# EAGLE design BlackIceMx (EAGLE 7.7.0)
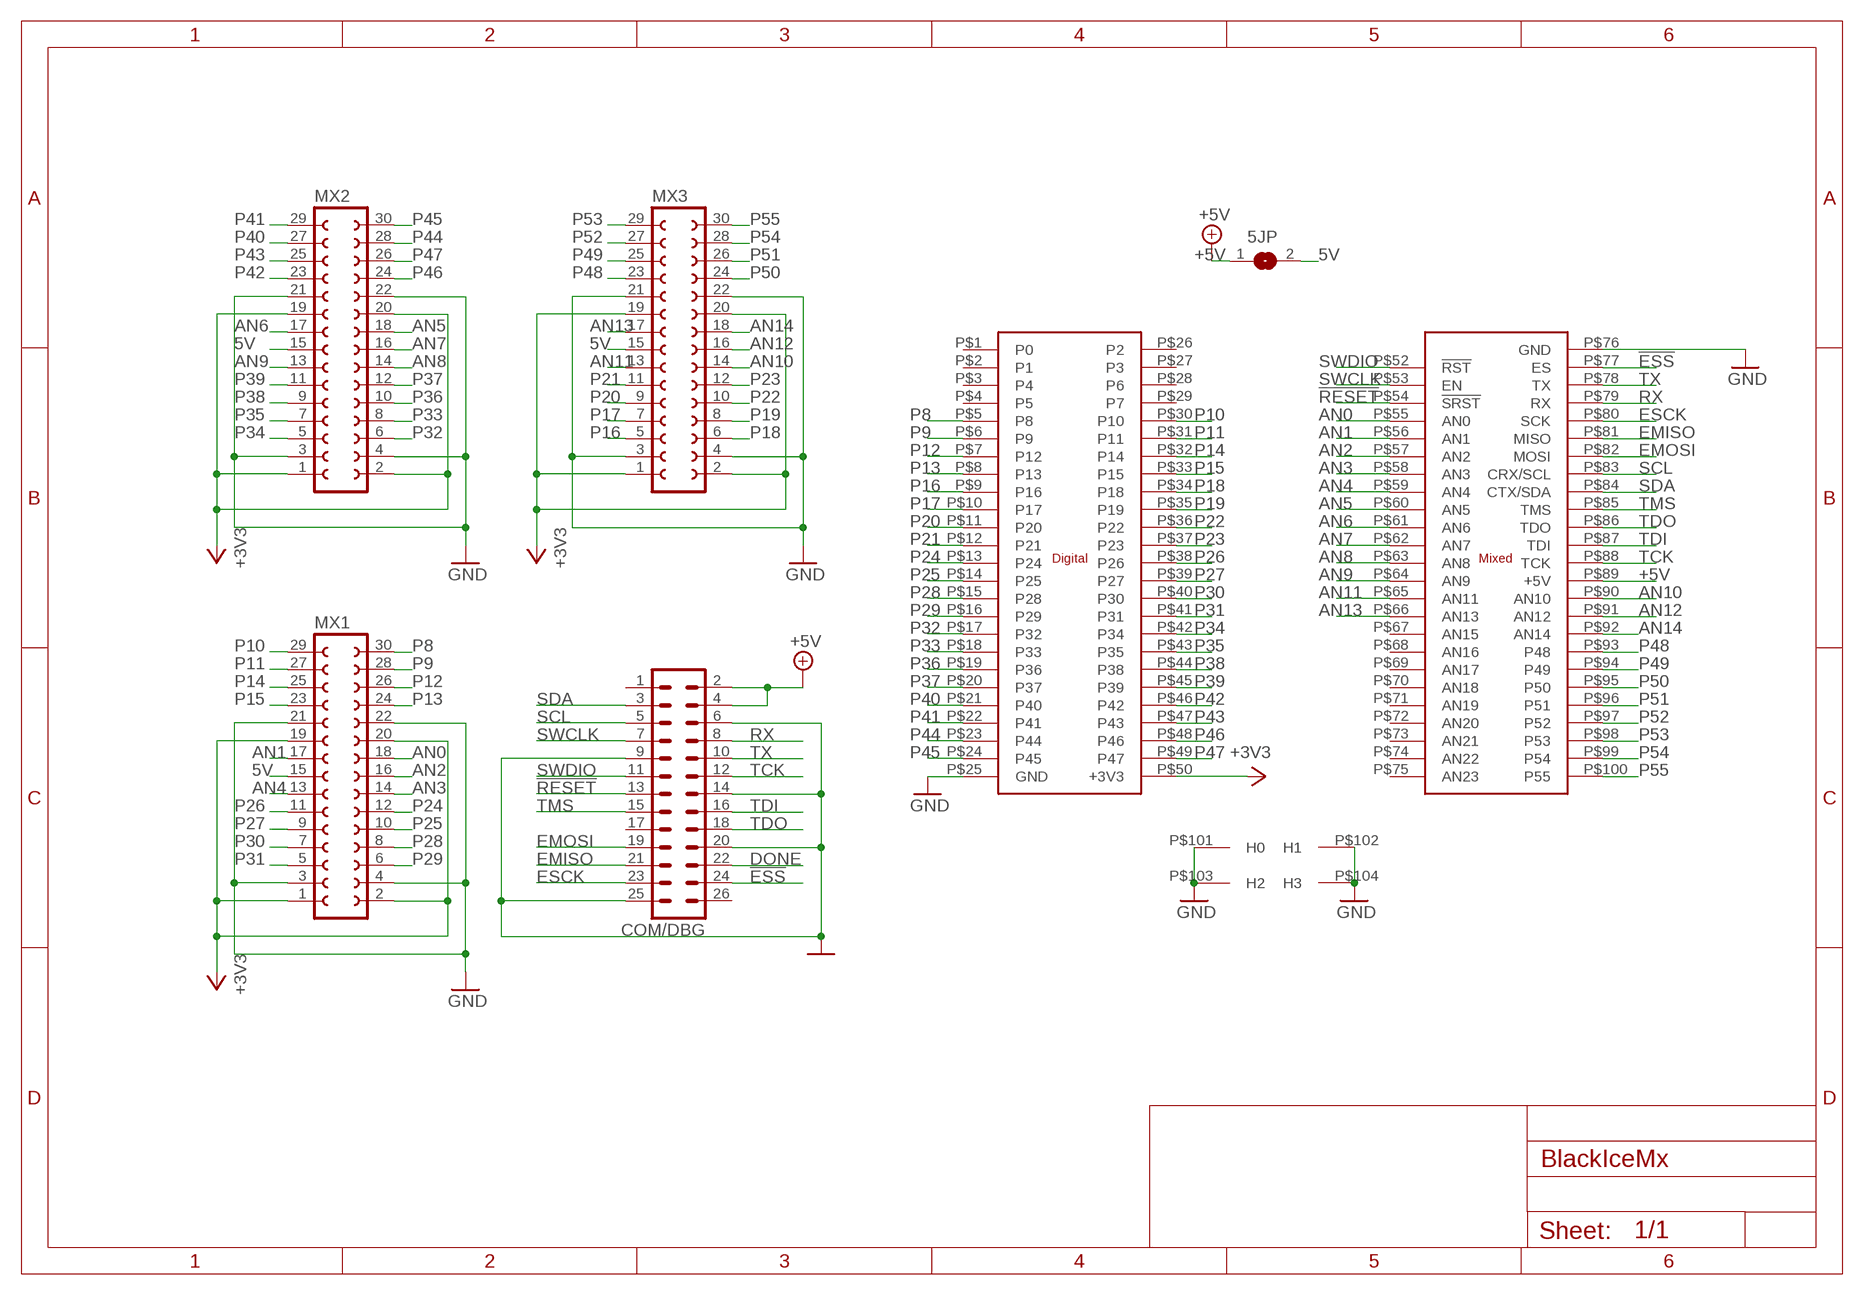
[diagram p0: schematic, sheet 1]

## Parts
5JP  SJ  [SJ]
COM/DBG  MA13-2  [MA13-2]
MX1  FE15-2  [FE15-2]
MX2  FE15-2  [FE15-2]
MX3  FE15-2  [FE15-2]
U$1  BE-CARRIERSMD  [BE-CARRIER-SMD]

## Nets
5V: 5JP.2 MX1.15 MX2.15 MX3.15
!ESS: COM/DBG.24 U$1.P$77(ES)
!RESET: COM/DBG.13 U$1.P$54(!SRST)
+3V3: MX1.1 MX1.2 MX1.19 MX1.20 MX2.1 MX2.2 MX2.19 MX2.20 MX3.1 MX3.2 MX3.19 MX3.20 U$1.P$50(+3V3)
+5V: 5JP.1 COM/DBG.2 COM/DBG.4 U$1.P$89(+5V)
AN0: MX1.18 U$1.P$55(AN0)
AN1: MX1.17 U$1.P$56(AN1)
AN2: MX1.16 U$1.P$57(AN2)
AN3: MX1.14 U$1.P$58(AN3)
AN4: MX1.13 U$1.P$59(AN4)
AN5: MX2.18 U$1.P$60(AN5)
AN6: MX2.17 U$1.P$61(AN6)
AN7: MX2.16 U$1.P$62(AN7)
AN8: MX2.14 U$1.P$63(AN8)
AN9: MX2.13 U$1.P$64(AN9)
AN10: MX3.14 U$1.P$90(AN10)
AN11: MX3.13 U$1.P$65(AN11)
AN12: MX3.16 U$1.P$91(AN12)
AN13: MX3.17 U$1.P$66(AN13)
AN14: MX3.18 U$1.P$92(AN14)
DONE: COM/DBG.22
EMISO: COM/DBG.21 U$1.P$81(MISO)
EMOSI: COM/DBG.19 U$1.P$82(MOSI)
ESCK: COM/DBG.23 U$1.P$80(SCK)
GND: COM/DBG.6 COM/DBG.9 COM/DBG.14 COM/DBG.20 COM/DBG.25 MX1.3 MX1.4 MX1.21 MX1.22 MX2.3 MX2.4 MX2.21 MX2.22 MX3.3 MX3.4 MX3.21 MX3.22 U$1.P$25(GND) U$1.P$76(GND) U$1.P$101(H0) U$1.P$102(H1) U$1.P$103(H2) U$1.P$104(H3)
P8: MX1.30 U$1.P$5(P8)
P9: MX1.28 U$1.P$6(P9)
P10: MX1.29 U$1.P$30(P10)
P11: MX1.27 U$1.P$31(P11)
P12: MX1.26 U$1.P$7(P12)
P13: MX1.24 U$1.P$8(P13)
P14: MX1.25 U$1.P$32(P14)
P15: MX1.23 U$1.P$33(P15)
P16: MX3.5 U$1.P$9(P16)
P17: MX3.7 U$1.P$10(P17)
P18: MX3.6 U$1.P$34(P18)
P19: MX3.8 U$1.P$35(P19)
P20: MX3.9 U$1.P$11(P20)
P21: MX3.11 U$1.P$12(P21)
P22: MX3.10 U$1.P$36(P22)
P23: MX3.12 U$1.P$37(P23)
P24: MX1.12 U$1.P$13(P24)
P25: MX1.10 U$1.P$14(P25)
P26: MX1.11 U$1.P$38(P26)
P27: MX1.9 U$1.P$39(P27)
P28: MX1.8 U$1.P$15(P28)
P29: MX1.6 U$1.P$16(P29)
P30: MX1.7 U$1.P$40(P30)
P31: MX1.5 U$1.P$41(P31)
P32: MX2.6 U$1.P$17(P32)
P33: MX2.8 U$1.P$18(P33)
P34: MX2.5 U$1.P$42(P34)
P35: MX2.7 U$1.P$43(P35)
P36: MX2.10 U$1.P$19(P36)
P37: MX2.12 U$1.P$20(P37)
P38: MX2.9 U$1.P$44(P38)
P39: MX2.11 U$1.P$45(P39)
P40: MX2.27 U$1.P$21(P40)
P41: MX2.29 U$1.P$22(P41)
P42: MX2.23 U$1.P$46(P42)
P43: MX2.25 U$1.P$47(P43)
P44: MX2.28 U$1.P$23(P44)
P45: MX2.30 U$1.P$24(P45)
P46: MX2.24 U$1.P$48(P46)
P47: MX2.26 U$1.P$49(P47)
P48: MX3.23 U$1.P$93(P48)
P49: MX3.25 U$1.P$94(P49)
P50: MX3.24 U$1.P$95(P50)
P51: MX3.26 U$1.P$96(P51)
P52: MX3.27 U$1.P$97(P52)
P53: MX3.29 U$1.P$98(P53)
P54: MX3.28 U$1.P$99(P54)
P55: MX3.30 U$1.P$100(P55)
RX: COM/DBG.8 U$1.P$79(RX)
SCL: COM/DBG.5 U$1.P$83(CRX/SCL)
SDA: COM/DBG.3 U$1.P$84(CTX/SDA)
SWCLK: COM/DBG.7 U$1.P$53(EN)
SWDIO: COM/DBG.11 U$1.P$52(!RST)
TCK: COM/DBG.12 U$1.P$88(TCK)
TDI: COM/DBG.16 U$1.P$87(TDI)
TDO: COM/DBG.18 U$1.P$86(TDO)
TMS: COM/DBG.15 U$1.P$85(TMS)
TX: COM/DBG.10 U$1.P$78(TX)
Unconnected: COM/DBG.1 COM/DBG.17 COM/DBG.26 U$1.P$1(P0) U$1.P$2(P1) U$1.P$3(P4) U$1.P$4(P5) U$1.P$26(P2) U$1.P$27(P3) U$1.P$28(P6) U$1.P$29(P7) U$1.P$51(NC) U$1.P$67(AN15) U$1.P$68(AN16) U$1.P$69(AN17) U$1.P$70(AN18) U$1.P$71(AN19) U$1.P$72(AN20) U$1.P$73(AN21) U$1.P$74(AN22) U$1.P$75(AN23)

## Library data of the parts
5JP = jumper:SJ: SMD solder JUMPER
COM/DBG = con-lstb:MA13-2: PIN HEADER; OC_FARNELL: unknown; OC_NEWARK: unknown
MX1-MX3 = con-lsta:FE15-2: FEMALE HEADER; OC_FARNELL: unknown; OC_NEWARK: unknown
U$1 = BlackEdge:BE-CARRIER

## Board
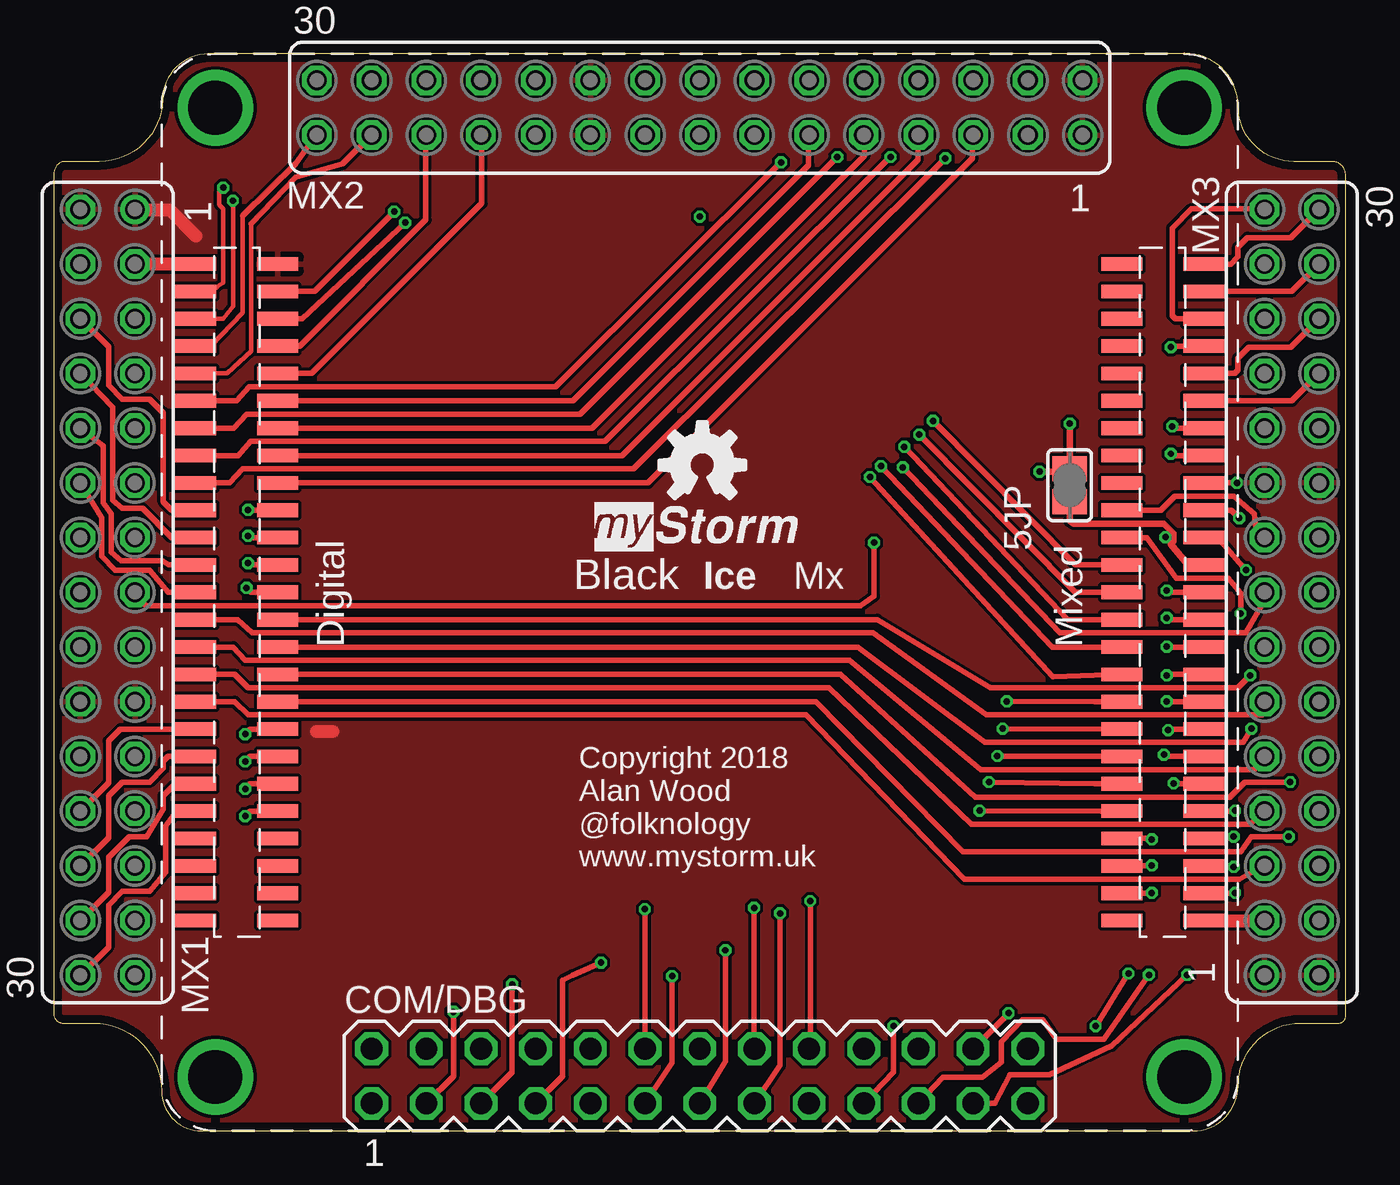
[diagram p1: board, top side]
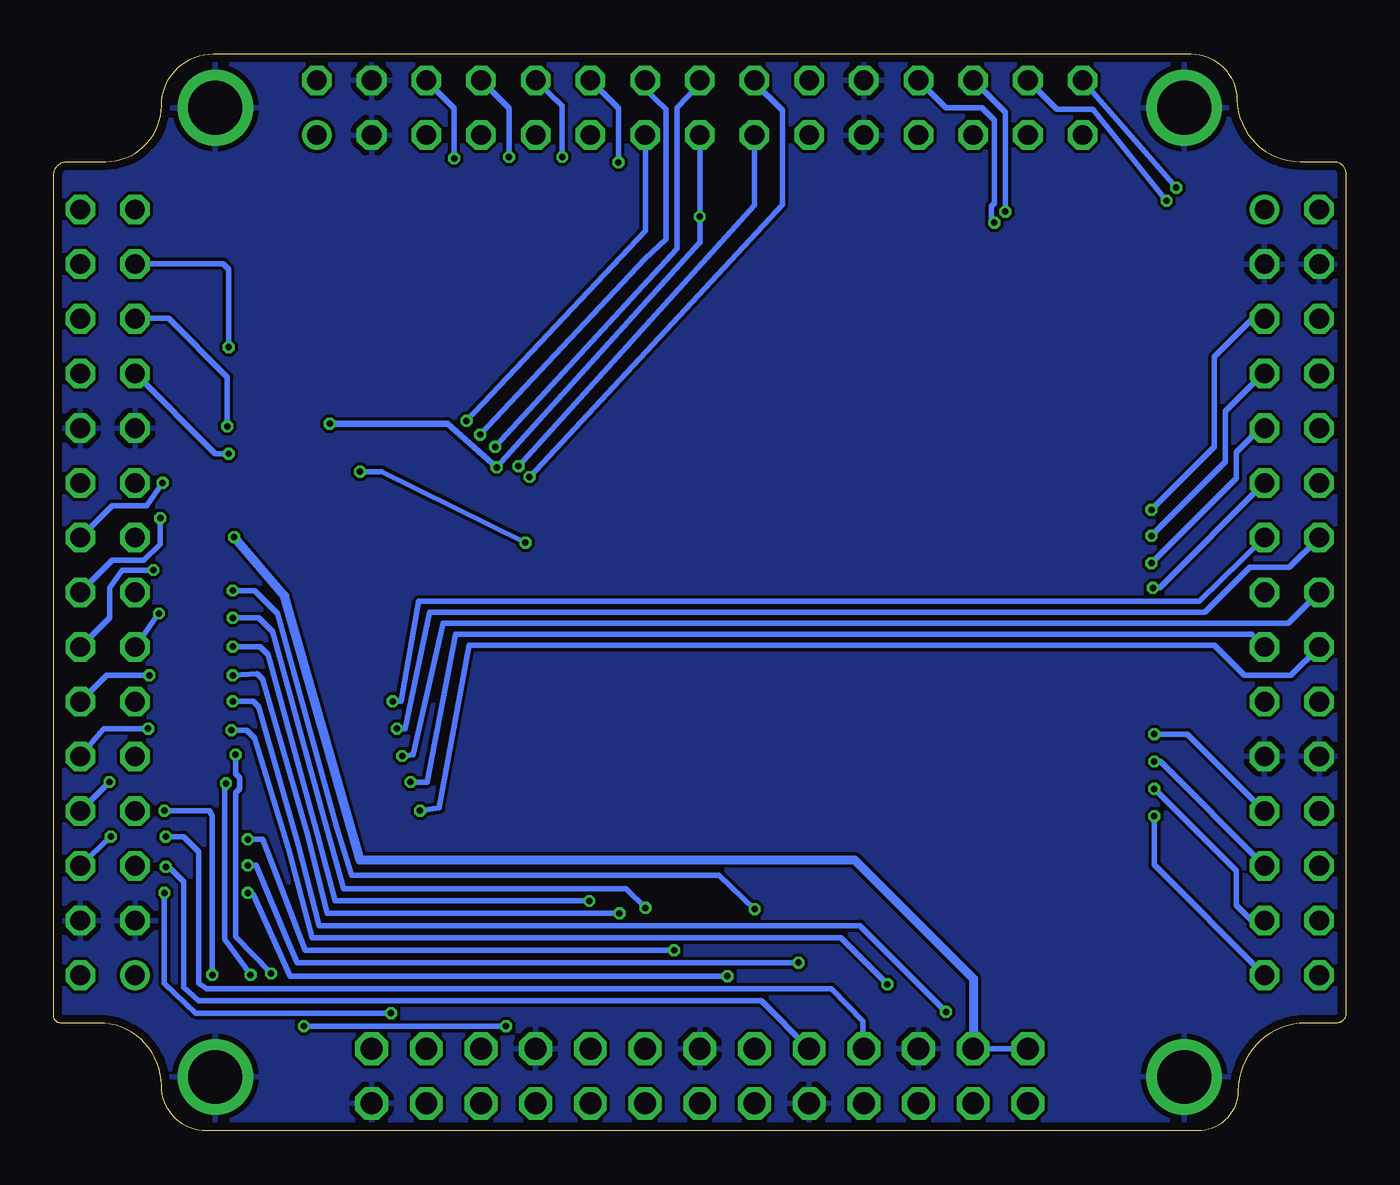
[diagram p2: board, bottom side, seen from below]

Size 60 x 50 mm. Coordinates in mm from the lower left corner, seen from the top.
Outline: 2.12,45 0.55,45 arc90 0,44.45 0,5.42 arc90 0.42,5 1.85,5 arc-90 5,1.85 arc90 6.85,0 52.91,0 arc90 55,2.09 arc-90 57.91,5 59.68,5 arc90 60,5.32 60,44.37 arc90 59.37,45 57.59,45 arc-90 55,47.59 arc90 52.59,50 7.2,50 arc89 5.05,47.88 arc-89 2.12,45
Copper layers (1*16): Top 0.035559375mm / dielectric 1.6mm / Bottom 0.035559375mm
Design rules "oshpark-2layer *": minimum track width 6mil, minimum drill 10mil, track to track 6mil, track to pad 6mil, pad to pad 6mil, via to via 6mil, smd to smd 6mil, copper to edge 15mil, drill to drill 6mil, minimum pad ring 5mil, minimum via ring 5mil, stop-mask expansion 2.5mil, vias tented up to drill 0.3mm, thermal gap 10mil

### Footprints (pad centres in the part's own frame; a part is rotated, then mirrored left to right if it is on the bottom)
SJ = smd 1.168 x 1.6: 1 -0.762,0; 2 0.762,0
MA13-2 = drill 1.016 octagon: 1 -15.24,-1.27; 2 -15.24,1.27; 3 -12.7,-1.27; 4 -12.7,1.27; 5 -10.16,-1.27; 6 -10.16,1.27; 7 -7.62,-1.27; 8 -7.62,1.27; 9 -5.08,-1.27; 10 -5.08,1.27; 11 -2.54,-1.27; 12 -2.54,1.27; 13 0,-1.27; 14 0,1.27; 15 2.54,-1.27; 16 2.54,1.27; 17 5.08,-1.27; 18 5.08,1.27; 19 7.62,-1.27; 20 7.62,1.27; 21 10.16,-1.27; 22 10.16,1.27; 23 12.7,-1.27; 24 12.7,1.27; 25 15.24,-1.27; 26 15.24,1.27
FE15-2 = drill 0.914: 1 -17.78,1.27 | drill 0.914 octagon: 2 -17.78,-1.27; 3 -15.24,1.27; 4 -15.24,-1.27; 5 -12.7,1.27; 6 -12.7,-1.27; 7 -10.16,1.27; 8 -10.16,-1.27; 9 -7.62,1.27; 10 -7.62,-1.27; 11 -5.08,1.27; 12 -5.08,-1.27; 13 -2.54,1.27; 14 -2.54,-1.27; 15 0,1.27; 16 0,-1.27; 17 2.54,1.27; 18 2.54,-1.27; 19 5.08,1.27; 20 5.08,-1.27; 21 7.62,1.27; 22 7.62,-1.27; 23 10.16,1.27; 24 10.16,-1.27; 25 12.7,1.27; 26 12.7,-1.27; 27 15.24,1.27; 28 15.24,-1.27; 29 17.78,1.27; 30 17.78,-1.27
BE-CARRIER-SMD = smd 0.635 x 1.905: P$1 -15.24,23.405; P$2 -13.97,23.405; P$3 -12.7,23.405; P$4 -11.43,23.405; P$5 -10.16,23.405; P$6 -8.89,23.405; P$7 -7.62,23.405; P$8 -6.35,23.405; P$9 -5.08,23.405; P$10 -3.81,23.405; P$11 -2.54,23.405; P$12 -1.27,23.405; P$13 0,23.405; P$14 1.27,23.405; P$15 2.54,23.405; P$16 3.81,23.405; P$17 5.08,23.405; P$18 6.35,23.405; P$19 7.62,23.405; P$20 8.89,23.405; P$21 10.16,23.405; P$22 11.43,23.405; P$23 12.7,23.405; P$24 13.97,23.405; P$25 15.24,23.405; P$26 -15.24,19.595; P$27 -13.97,19.595; P$28 -12.7,19.595; P$29 -11.43,19.595; P$30 -10.16,19.595; P$31 -8.89,19.595; P$32 -7.62,19.595; P$33 -6.35,19.595; P$34 -5.08,19.595; P$35 -3.81,19.595; P$36 -2.54,19.595; P$37 -1.27,19.595; P$38 0,19.595; P$39 1.27,19.595; P$40 2.54,19.595; P$41 3.81,19.595; P$42 5.08,19.595; P$43 6.35,19.595; P$44 7.62,19.595; P$45 8.89,19.595; P$46 10.16,19.595; P$47 11.43,19.595; P$48 12.7,19.595; P$49 13.97,19.595; P$50 15.24,19.595; P$51 -15.24,-19.595; P$52 -13.97,-19.595; P$53 -12.7,-19.595; P$54 -11.43,-19.595; P$55 -10.16,-19.595; P$56 -8.89,-19.595; P$57 -7.62,-19.595; P$58 -6.35,-19.595; P$59 -5.08,-19.595; P$60 -3.81,-19.595; P$61 -2.54,-19.595; P$62 -1.27,-19.595; P$63 0,-19.595; P$64 1.27,-19.595; P$65 2.54,-19.595; P$66 3.81,-19.595; P$67 5.08,-19.595; P$68 6.35,-19.595; P$69 7.62,-19.595; P$70 8.89,-19.595; P$71 10.16,-19.595; P$72 11.43,-19.595; P$73 12.7,-19.595; P$74 13.97,-19.595; P$75 15.24,-19.595; P$76 -15.24,-23.405; P$77 -13.97,-23.405; P$78 -12.7,-23.405; P$79 -11.43,-23.405; P$80 -10.16,-23.405; P$81 -8.89,-23.405; P$82 -7.62,-23.405; P$83 -6.35,-23.405; P$84 -5.08,-23.405; P$85 -3.81,-23.405; P$86 -2.54,-23.405; P$87 -1.27,-23.405; P$88 0,-23.405; P$89 1.27,-23.405; P$90 2.54,-23.405; P$91 3.81,-23.405; P$92 5.08,-23.405; P$93 6.35,-23.405; P$94 7.62,-23.405; P$95 8.89,-23.405; P$96 10.16,-23.405; P$97 11.43,-23.405; P$98 12.7,-23.405; P$99 13.97,-23.405; P$100 15.24,-23.405 | drill 2.5: P$101 -22.5,22.5; P$102 22.5,22.5; P$103 -22.5,-22.5; P$104 22.5,-22.5

### Placement (x,y rotation side)
5JP  47.18,29.97 90 top
COM/DBG  30,2.54 0 top
MX1  2.5,25 270 top
MX2  30,47.5 180 top
MX3  57.5,25 90 top
U$1  30,25 90 top

### Tracks (layer width: path | path; a pad name or v marks a point on that pad's centre or on a via)
5V  (via drill 0.3)
  Top 0.254: MX3.15 56.23,24.61 55.37,23.11 46.74,23.11 v39.43,30.8 | MX1.15 4.26,24.38 37.47,24.38 38.1,24.83 v38.1,27.3 | 47.24,30.61 5JP.2
  Top 0.305: 5JP.2 v47.18,32.83 | v45.78,30.61 47.24,30.61
  Bottom 0.254: MX2.15 v30,42.45 30,41.25 30.04,41.21 v39.43,30.8 39.5,30.86 | v38.1,27.3 44.77,30.61 v45.78,30.61
  Bottom 0.305: v47.18,32.83 41.72,32.83 v39.43,30.8
!ESS  (via drill 0.3)
  Top 0.254: U$1.P$77 54.84,11.03 v54.86,11.05 | v44.34,5.46 44.29,5.4 COM/DBG.24
  Bottom 0.254: v54.86,11.05 54.86,6.86 53.4,5.46 v44.34,5.46 44.31,5.42
!RESET  (via drill 0.3)
  Top 0.254: U$1.P$54 50.88,13.57 v50.99,13.53 | v31.19,8.38 31.19,3.23 COM/DBG.13
  Bottom 0.254: v50.99,13.53 50.29,13.53 49.97,12.7 48.32,8.38 v31.19,8.38
+3V3
  Top 0.61: 6.59,41.54 5.4,42.74 3.81,42.74 MX1.1 | 12.19,18.54 12.95,18.54
  pour Top: 0,50 60,50 60,0 0,0
+5V  (via drill 0.3)
  Top 0.254: U$1.P$89 52.66,26.27
  Top 0.305: 52.66,26.27 51.88,27.24 52.01,27.37 | 52.01,27.37 52.01,27.75 51.56,28.19 47.37,28.19 47.18,28.32 5JP.1 | v51.63,27.56 52.01,27.37
  Bottom 0.254: COM/DBG.2 COM/DBG.4
  Bottom 0.406: v51.63,27.56 49.28,24.83 45.78,12.57 22.81,12.57 17.29,7.05 17.29,3.82 COM/DBG.4
AN0  (via drill 0.3)
  Top 0.254: U$1.P$55 48.66,14.84 v42.99,14.86
  Bottom 0.254: v42.99,14.86 42.1,14.99 40.7,22.54 6.1,22.54 4.7,21.14 2.54,21.14 MX1.18
AN1  (via drill 0.3)
  Top 0.254: U$1.P$56 48.34,16.11 v43.43,16.19
  Bottom 0.254: v43.43,16.19 42.67,16.19 41.34,23.05 4.36,23.05 MX1.17
AN2  (via drill 0.3)
  Top 0.254: U$1.P$57 48.91,17.38 v43.81,17.4
  Bottom 0.254: v43.81,17.4 43.31,17.46 41.91,23.56 2.67,23.56 MX1.16
AN3  (via drill 0.3)
  Top 0.254: U$1.P$58 48.72,18.65 v44.07,18.67
  Bottom 0.254: v44.07,18.67 43.69,18.67 42.55,24.07 6.54,24.07 4.45,26.16 2.61,26.16 MX1.14
AN4  (via drill 0.3)
  Top 0.254: U$1.P$59 48.34,19.92 v44.26,19.94
  Bottom 0.254: v44.26,19.94 43.88,19.94 43.05,24.57 6.8,24.57 MX1.13
AN5  (via drill 0.3)
  Top 0.254: U$1.P$60 46.4,21.08 v37.91,30.35
  Bottom 0.254: v37.91,30.35 26.16,42.99 26.16,47.37 27.46,48.67 MX2.18
AN6  (via drill 0.3)
  Top 0.254: U$1.P$61 46.37,22.46 v38.42,30.86
  Bottom 0.254: v38.42,30.86 27.46,42.96 MX2.17
AN7  (via drill 0.3)
  Top 0.254: U$1.P$62 47.1,23.73 v39.5,31.75
  Bottom 0.254: v39.5,31.75 31.05,40.96 31.05,47.5 30,48.61 MX2.16
AN8  (via drill 0.3)
  Top 0.254: U$1.P$63 47.45,25 v40.2,32.32
  Bottom 0.254: v40.2,32.32 32.54,40.48 31.56,41.4 31.56,47.43 32.54,48.35 MX2.14
AN9  (via drill 0.3)
  Top 0.254: U$1.P$64 47.45,26.27 v40.83,32.96
  Bottom 0.254: v40.83,32.96 32.51,41.78 32.51,46.2 MX2.13
AN10  (via drill 0.3)
  Top 0.254: U$1.P$90 54.06,27.54 v55.37,26.04
  Bottom 0.254: v55.37,26.04 56.83,26.04 57.4,25.21 57.4,23.83 MX3.14
AN11  (via drill 0.3)
  Top 0.254: U$1.P$65 50.76,27.54 52.13,25.65 54.55,25.65 55.12,24.96 v55.12,24.02
  Bottom 0.254: v55.12,24.02 MX3.13
AN12  (via drill 0.3)
  Top 0.254: U$1.P$91 54.69,28.81 v55.05,28.45
  Bottom 0.254: v55.05,28.45 55.05,27.24 55.82,26.48 57.29,26.48 MX3.16
AN13
  Top 0.254: U$1.P$66 51.42,28.81 52.07,29.46 54.8,29.46 55.75,28.64 55.82,27.95 MX3.17
AN14  (via drill 0.3)
  Top 0.254: U$1.P$92 v54.95,30.08
  Bottom 0.254: v54.95,30.08 55.69,29.02 57.29,29.02 MX3.18
EMISO  (via drill 0.3)
  Top 0.254: U$1.P$81 52.15,16.11 v52.01,16.13 | v50.86,7.24 48.77,4.25 46.56,4.25 45.93,5.14 44.97,5.14 44.02,4.13 44.02,3.17 43.13,2.48 41.29,2.48 COM/DBG.21
  Bottom 0.254: v52.01,16.13 52.01,15.94 52.07,15.88 52.07,8.89 v50.86,7.24
EMOSI  (via drill 0.3)
  Top 0.254: U$1.P$82 51.65,17.38 v51.56,17.46 | v49.91,7.3 v48.39,4.86 | v39.01,4.86 39.01,2.72 COM/DBG.19
  Bottom 0.254: v51.56,17.46 51.56,16.57 51.37,16.38 51.37,15.88 51.56,15.68 51.56,9.02 v49.91,7.3 | v48.39,4.86 v39.01,4.86
ESCK  (via drill 0.3)
  Top 0.254: U$1.P$80 54.84,14.84 v54.86,14.86 | v52.64,7.24 49.15,3.94 46.23,2.6 44.4,2.6 43.7,1.27 COM/DBG.23
  Bottom 0.254: v54.86,14.86 52.77,14.86 52.64,14.61 v52.64,7.24
GND
  Top 0.61: U$1.P$76 MX3.3 | U$1.P$25 MX1.3
  pour Bottom: 0,50 60.06,50 59.94,0 0,0
P8
  Top 0.254: U$1.P$5 5.57,14.65 5.21,14.16 5.21,12 4.45,11.11 3.17,11.11 2.54,10.48 2.54,8.53 MX1.30
P9
  Top 0.254: U$1.P$6 5.63,16.11 5.08,15.56 5.08,14.92 4.32,13.65 3.49,13.65 2.54,12.7 2.54,11.07 MX1.28
P10  (via drill 0.3)
  Top 0.254: U$1.P$30 9.12,14.84 v8.89,14.61
  Bottom 0.254: v8.89,14.61 8.89,12.34 MX1.29
P11  (via drill 0.3)
  Top 0.254: U$1.P$31 9.12,16.11 v8.89,15.88
  Bottom 0.254: v8.89,15.88 5.08,12.06 5.08,10.48 4.36,9.76 MX1.27
P12
  Top 0.254: U$1.P$7 5.32,17.38 5.08,17.14 5.08,16.83 4.45,16.19 3.17,16.19 2.54,15.56 2.54,13.61 MX1.26
P13
  Top 0.254: U$1.P$8 3.09,18.65 2.54,18.1 2.54,16.15 MX1.24
P14  (via drill 0.3)
  Top 0.254: U$1.P$32 9.12,17.38 v8.89,17.14
  Bottom 0.254: v8.89,17.14 8.62,17.14 MX1.25
P15  (via drill 0.3)
  Top 0.254: U$1.P$33 9.12,18.65 v8.89,18.41
  Bottom 0.254: v8.89,18.41 7.34,18.41 MX1.23
P16
  Top 0.254: U$1.P$9 8.4,19.92 9.02,19.3 34.92,19.3 42.29,11.68 55.07,11.68 MX3.5
P17
  Top 0.254: U$1.P$10 8.4,21.19 9.02,20.57 36.01,20.57 42.61,14.22 55.58,14.22 MX3.7
P18  (via drill 0.3)
  Top 0.254: U$1.P$34 35.39,19.92 42.23,12.95 55.12,12.95 55.63,13.65 v57.35,13.65
  Bottom 0.254: v57.35,13.65 MX3.6
P19  (via drill 0.3)
  Top 0.254: U$1.P$35 36.53,21.19 42.8,15.49 54.61,15.49 55.31,16.19 v57.42,16.19
  Bottom 0.254: v57.42,16.19 MX3.8
P20
  Top 0.254: U$1.P$11 8.34,22.46 8.89,21.84 36.96,21.84 43.05,16.76 55.77,16.76 MX3.9
P21
  Top 0.254: U$1.P$12 8.53,23.73 9.21,23.11 38.04,23.11 43.31,19.3 56.12,19.3 MX3.11
P22  (via drill 0.3)
  Top 0.254: U$1.P$36 37.36,22.46 43.24,18.03 55.24,18.03 v55.63,18.67
  Bottom 0.254: v55.63,18.67 57.67,18.67 MX3.10
P23  (via drill 0.3)
  Top 0.254: U$1.P$37 38.25,23.73 43.5,20.57 54.99,20.57 v55.56,21.14
  Bottom 0.254: v55.56,21.14 57.54,21.14 MX3.12
P24
  Top 0.254: U$1.P$13 5.32,25 4.45,26.04 2.86,26.04 2.22,26.67 2.22,28.45 MX1.12
P25
  Top 0.254: U$1.P$14 5.33,26.27 5.04,26.46 3.13,26.46 2.67,26.86 2.67,28.64 2.29,29.15 2.29,31.81 MX1.10
P26  (via drill 0.3)
  Top 0.254: U$1.P$38 9.16,25 v8.95,25.21
  Bottom 0.254: v8.95,25.21 8.64,25.21 MX1.11
P27  (via drill 0.3)
  Top 0.254: U$1.P$39 9.1,26.27 v9.02,26.35
  Bottom 0.254: v9.02,26.35 5.08,30.29 5.08,31.5 3.96,32.62 MX1.9
P28
  Top 0.254: U$1.P$15 5.48,27.54 4.13,28.89 3.17,28.89 2.73,29.27 2.73,33.6 MX1.8
P29
  Top 0.254: U$1.P$16 5.48,28.81 5.08,29.21 5.08,33.34 4.45,33.97 3.17,33.97 2.54,34.61 2.54,36.39 MX1.6
P30  (via drill 0.3)
  Top 0.254: U$1.P$40 9.1,27.54 v9.02,27.62
  Bottom 0.254: v9.02,27.62 5.59,31.05 5.59,33.4 3.83,35.16 MX1.7
P31  (via drill 0.3)
  Top 0.254: U$1.P$41 9.04,28.81 v9.02,28.83
  Bottom 0.254: v9.02,28.83 6.1,31.75 6.1,35.94 4.34,37.7 MX1.5
P32  (via drill 0.3)
  Top 0.254: U$1.P$17 8.17,30.08 8.76,30.73 26.92,30.73 v41.4,45.15
  Bottom 0.254: v41.4,45.15 41.4,47.47 MX2.6
P33  (via drill 0.3)
  Top 0.254: U$1.P$18 8.55,31.35 9.14,32 25.59,32 v38.86,45.21
  Bottom 0.254: v38.86,45.21 38.86,47.47 MX2.8
P34
  Top 0.254: U$1.P$42 27.6,30.08 42.67,45.15 42.67,46.2 MX2.5
P35
  Top 0.254: U$1.P$43 26.4,31.35 40.13,45.09 40.13,46.2 MX2.7
P36  (via drill 0.3)
  Top 0.254: U$1.P$19 8.36,32.62 8.95,33.27 24.45,33.27 v36.39,45.21
  Bottom 0.254: v36.39,45.21 36.39,47.6 MX2.10
P37  (via drill 0.3)
  Top 0.254: U$1.P$20 8.49,33.89 9.08,34.54 23.3,34.54 v33.78,44.96
  Bottom 0.254: v33.78,44.96 33.78,47.47 MX2.12
P38
  Top 0.254: U$1.P$44 25,32.62 37.66,45.28 37.66,46.19 MX2.9
P39
  Top 0.254: U$1.P$45 24.11,33.89 35.05,44.83 35.05,46.2 MX2.11
P40
  Top 0.2: U$1.P$21 8.05,35.16 9.17,36.2 9.17,42.1
  Top 0.254: 9.17,42.1 11.24,44.26 13.43,44.9 MX2.27
P41
  Top 0.2: 7.28,36.43 8.76,37.97 8.76,42.48
  Top 0.254: U$1.P$22 7.28,36.43 | 8.76,42.48 11.24,44.9 12.09,46.1 MX2.29
P42
  Top 0.254: U$1.P$46 11.98,35.16 19.88,43.05 19.88,46.19 MX2.23
P43
  Top 0.254: U$1.P$47 11.41,36.43 17.27,42.29 17.27,46.2 MX2.25
P44  (via drill 0.3)
  Top 0.2: U$1.P$23 7.86,37.7 8.32,38.29 v8.32,43.18
  Bottom 0.254: v8.32,43.18 11.75,47.43 13.43,47.43 MX2.28
P45  (via drill 0.3)
  Top 0.2: 7.54,39.16 7.87,39.37 7.87,42.8 7.68,42.99 7.68,43.6 v7.87,43.79
  Top 0.254: U$1.P$24 7.54,39.16
  Bottom 0.254: v7.87,43.79 MX2.30
P46  (via drill 0.3)
  Top 0.254: U$1.P$48 11.54,37.7 v16.32,42.16
  Bottom 0.254: v16.32,42.16 16.45,42.29 16.45,42.93 16.32,43.05 16.32,46.93 16.89,47.5 18.57,47.5 MX2.24
P47  (via drill 0.3)
  Top 0.254: U$1.P$49 12.11,38.97 v15.81,42.67
  Bottom 0.254: v15.81,42.67 15.81,47.28 MX2.26
P48  (via drill 0.3)
  Top 0.254: U$1.P$93 51.96,31.35 v51.88,31.43
  Bottom 0.254: v51.88,31.43 52.5,31.43 MX3.23
P49  (via drill 0.3)
  Top 0.254: U$1.P$94 52.03,32.62 v51.94,32.7
  Bottom 0.254: v51.94,32.7 51.94,34.99 54.67,37.72 56.21,37.72 MX3.25
P50
  Top 0.254: U$1.P$95 57.5,33.89 MX3.24
P51
  Top 0.254: U$1.P$96 54.84,35.16 54.99,35.31 54.99,35.88 55.5,36.39 57.46,36.39 MX3.26
P52  (via drill 0.3)
  Top 0.254: U$1.P$97 51.92,36.43 v51.88,36.39
  Bottom 0.254: v51.88,36.39 51.88,40.01 52.13,40.26 56.21,40.26 MX3.27
P53
  Top 0.254: U$1.P$98 52.09,37.7 51.94,37.85 51.94,41.91 52.83,42.8 56.21,42.8 MX3.29
P54
  Top 0.254: U$1.P$99 57.5,38.97 MX3.28
P55
  Top 0.254: U$1.P$100 54.65,40.24 54.99,40.58 54.99,41.02 55.44,41.47 57.46,41.47 MX3.30
RX  (via drill 0.3)
  Top 0.254: U$1.P$79 54.72,13.57 v54.8,13.65
  Bottom 0.254: v54.8,13.65 53.98,13.65 53.28,12.95 53.28,6.86 52.9,6.6 23.89,6.6 22.43,5.08 22.43,3.86 COM/DBG.8
SCL  (via drill 0.3)
  Top 0.254: U$1.P$83 51.8,18.65 v51.75,18.61 | v21.29,6.79 21.29,2.72 COM/DBG.5
  Bottom 0.254: v51.75,18.61 51.05,18.61 50.67,18.22 49.09,13.08 48.01,8.95 23.45,8.95 v21.29,6.79
SDA  (via drill 0.3)
  Top 0.254: U$1.P$84 51.71,19.92 v51.69,19.94 | v18.56,5.52 18.56,2.53 COM/DBG.3
  Bottom 0.254: v51.69,19.94 50.74,19.94 50.48,19.68 48.64,13.21 47.69,9.53 22.56,9.53 v18.56,5.52
SWCLK  (via drill 0.3)
  Top 0.254: U$1.P$53 50.84,12.3 v50.99,12.32 | v25.42,7.81 24.08,7.23 23.64,6.99 23.64,2.53 COM/DBG.7
  Bottom 0.254: v50.99,12.32 50.61,12.32 49.28,9.14 48.7,7.81 v25.42,7.81
SWDIO  (via drill 0.3)
  Top 0.254: U$1.P$52 50.97,11.03 v50.99,11.05 | v28.72,7.18 28.72,3.16 COM/DBG.11
  Bottom 0.254: v50.99,11.05 50.74,10.99 49.02,7.18 v28.72,7.18
TCK  (via drill 0.3)
  Top 0.254: U$1.P$88 51.77,25 v51.69,25.08 | v27.45,10.29 27.45,3.82 COM/DBG.12
  Bottom 0.254: v51.69,25.08 50.67,25.08 49.59,24 46.86,14.1 46.16,11.87 29.1,11.87 v27.45,10.29
TDI  (via drill 0.3)
  Top 0.254: U$1.P$87 51.77,23.73 v51.69,23.81 | v32.53,10.35 32.53,3.82 COM/DBG.16
  Bottom 0.254: v51.69,23.81 50.48,23.81 49.85,23.18 47.31,13.97 46.55,11.24 33.42,11.24 v32.53,10.35
TDO  (via drill 0.3)
  Top 0.254: U$1.P$86 51.71,22.46 v51.69,22.48 | v35.13,10.67 35.13,3.86 COM/DBG.18
  Bottom 0.254: v51.69,22.48 50.42,22.48 50.04,22.1 47.75,13.72 46.93,10.67 v35.13,10.67
TMS  (via drill 0.3)
  Top 0.254: U$1.P$85 51.73,21.19 v51.69,21.14 | v33.73,10.1 33.73,3.04 COM/DBG.15
  Bottom 0.254: v51.69,21.14 50.55,21.21 50.29,20.95 48.2,13.65 47.31,10.1 v33.73,10.1
TX  (via drill 0.3)
  Top 0.254: U$1.P$78 54.76,12.3 v54.8,12.26
  Bottom 0.254: v54.8,12.26 54.67,12.26 53.98,11.56 53.98,6.67 53.28,6.03 27.14,6.03 COM/DBG.10

### Text on the board
tPlace: Copyright 2018 / Alan Wood / @folknology / www.mystorm.uk
tNames: Black | Ice | Mx